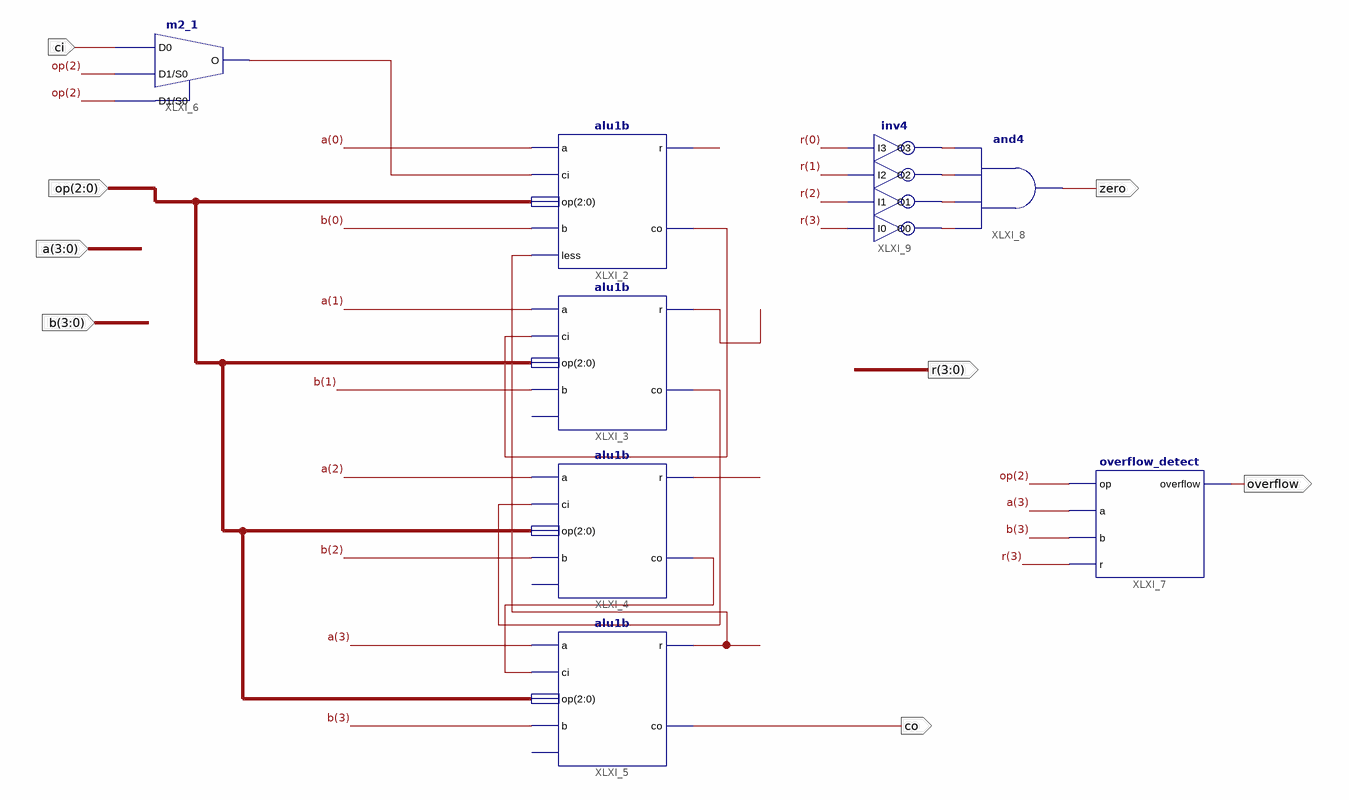
[diagram p0: schematic sheet 1]
// Xilinx ISE schematic alu.sch (spartan3e) as structural Verilog: 8 symbols, 8 ports
module alu (
  input  [3:0] a,
  input  [3:0] b,
  input  [2:0] op,
  input  ci,
  output [3:0] r,
  output co,
  output zero,
  output overflow
);

  wire XLXN_1, XLXN_2, XLXN_3, XLXN_32, XLXN_33, XLXN_34, XLXN_35, XLXN_36;

  alu1b XLXI_2 (.a(a[0]), .ci(XLXN_32), .op(op), .b(b[0]), .r(r[0]), .co(XLXN_1), .less(r[3]));
  alu1b XLXI_3 (.a(a[1]), .ci(XLXN_1), .op(op), .b(b[1]), .r(r[1]), .co(XLXN_2));  // open: less
  alu1b XLXI_4 (.a(a[2]), .ci(XLXN_2), .op(op), .b(b[2]), .r(r[2]), .co(XLXN_3));  // open: less
  alu1b XLXI_5 (.a(a[3]), .ci(XLXN_3), .op(op), .b(b[3]), .r(r[3]), .co(co));  // open: less
  m2_1 XLXI_6 (.D0(ci), .D1(op[2]), .S0(op[2]), .O(XLXN_32));
  overflow_detect XLXI_7 (.op(op[2]), .a(a[3]), .b(b[3]), .r(r[3]), .overflow(overflow));
  and XLXI_8 (zero, XLXN_33, XLXN_34, XLXN_35, XLXN_36);
  inv4 XLXI_9 (.I0(r[3]), .I1(r[2]), .I2(r[1]), .I3(r[0]), .O0(XLXN_33), .O1(XLXN_34), .O2(XLXN_35), .O3(XLXN_36));
endmodule
